# Altium schematic sheet CM6206.SchDoc
size 431 x 279 mm; Organization: ORGANIZATION; Address1: ADDRESS 1; Address2: ADDRESS 2; Address3: ADDRESS 3; Address4: ADDRESS 4; Revision: -; SheetNumber: 3; SheetTotal: 6; ENG_APP_DATE: --/--/--; DSN_APP_DATE: --/--/--; CHK_APP_DATE: --/--/--
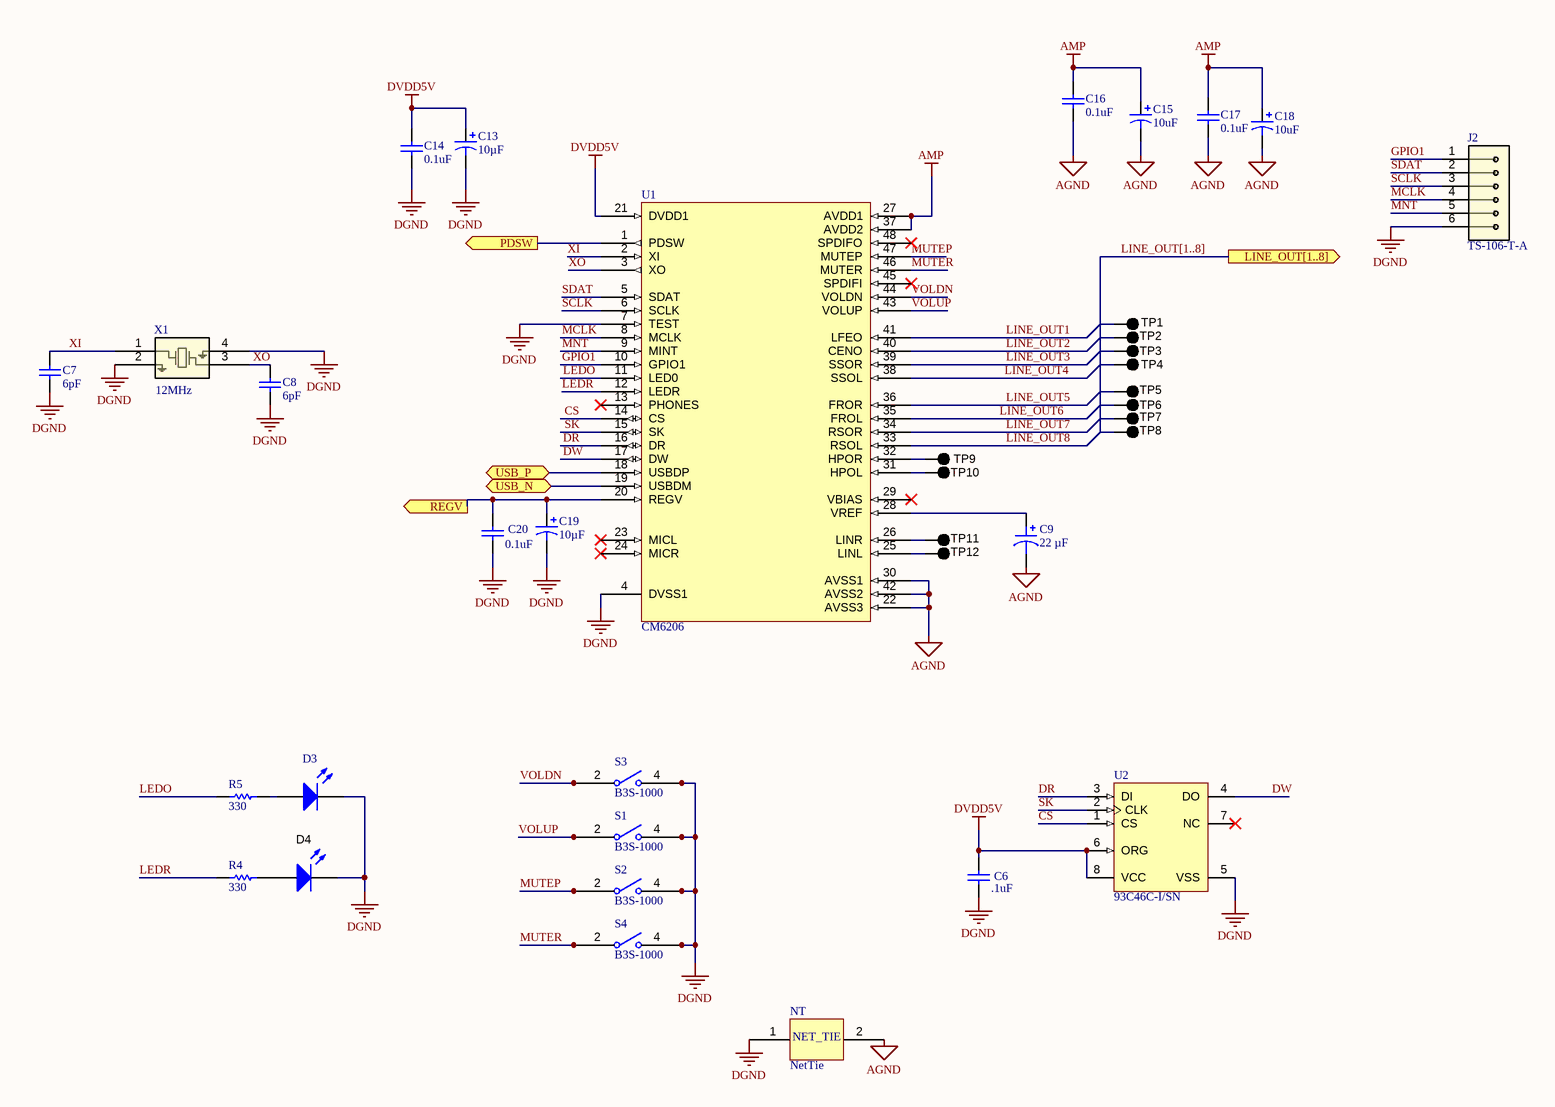
[diagram p0: CM6206.SchDoc]

## Parts
C6  .1uF  [0603]
C7  6pF  [0603]
C8  6pF  [0603]
C9  22 µF  [CAP POL 1411_3528]
C13  10µF  [1206 TANT CASE A]
C14  0.1uF  [0603]
C15  10uF  [1206 TANT CASE A]
C16  0.1uF  [0603]
C17  0.1uF  [0603]
C18  10uF  [1206 TANT CASE A]
C19  10µF  [1206 TANT CASE A]
C20  0.1uF  [0603]
D3  LTST-C190KGKT  [LED_LTST-C190]  (value not drawn)
D4  LB Q39G-L2OO-35-1  [LB Q39G_BLUE]  (value not drawn)
J2  TS-106-T-A  [CON6_1X6_TU_HTS_SAI]
NT  NetTie  [NetTie]  (net tie, no BOM)
R4  330  [0603]
R5  330  [0603]
S1  B3S-1000  [B3S-1000_OMR]
S2  B3S-1000  [B3S-1000_OMR]
S3  B3S-1000  [B3S-1000_OMR]
S4  B3S-1000  [B3S-1000_OMR]
TP1  5001  [Testpoint pad]  (value not drawn)
TP2  5001  [Testpoint pad]  (value not drawn)
TP3  5001  [Testpoint pad]  (value not drawn)
TP4  5001  [Testpoint pad]  (value not drawn)
TP5  5001  [Testpoint pad]  (value not drawn)
TP6  5001  [Testpoint pad]  (value not drawn)
TP7  5001  [Testpoint pad]  (value not drawn)
TP8  5001  [Testpoint pad]  (value not drawn)
TP9  5001  [Testpoint pad]  (value not drawn)
TP10  5001  [Testpoint pad]  (value not drawn)
TP11  5001  [Testpoint pad]  (value not drawn)
TP12  5001  [Testpoint pad]  (value not drawn)
U1  CM6206  [CM6206 LQFP48]
U2  93C46C-I/SN  [SOIC-SN8_N]
X1  ECS-120-8-36-CKM-TR3  [ECS-120-8_ECS]  (value not drawn)

## Ports
LINE_OUT[1..8] (out, see Top Level[6D]), PDSW (out, see Top Level[6E], Power[7E]), REGV (out, see Top Level[6E], USB Interface[5D]), USB_N (bidir, see Top Level[6E], USB Interface[5D]), USB_P (bidir, see Top Level[6E], USB Interface[5D])

## Nets
AGND: C9.2 C15.1 C16.1 C17.1 C18.1 NT.2 U1.22(AVSS3) U1.30(AVSS1) U1.42(AVSS2)
AMP: C15.2 C16.2 C17.2 C18.2 U1.27(AVDD1) U1.37(AVDD2)
DGND: C6.1 C7.1 C8.1 C13.1 C14.1 C19.1 C20.1 D3.2(K) D4.2(K) J2.6 NT.1 S1.3 S1.4 S2.3 S2.4 S3.3 S3.4 S4.3 S4.4 U1.4(DVSS1) U1.7(TEST) U2.5(VSS) X1.2 X1.4
DVDD5V: C6.2 C13.2 C14.2 U1.21(DVDD1) U2.6(ORG) U2.8(VCC)
CS: U1.14(CS) U2.1(CS)
DR: U1.16(DR) U2.3(DI)
DW: U1.17(DW) U2.4(DO)
GPIO1: J2.1 U1.10(GPIO1)
LEDO: R5.2 U1.11(LED0)
LEDR: R4.2 U1.12(LEDR)
LINE_OUT1: TP1.1 U1.41(LFEO)
LINE_OUT2: TP2.1 U1.40(CENO)
LINE_OUT3: TP3.1 U1.39(SSOR)
LINE_OUT4: TP4.1 U1.38(SSOL)
LINE_OUT5: TP5.1 U1.36(FROR)
LINE_OUT6: TP6.1 U1.35(FROL)
LINE_OUT7: TP7.1 U1.34(RSOR)
LINE_OUT8: TP8.1 U1.33(RSOL)
MCLK: J2.4 U1.8(MCLK)
MNT: J2.5 U1.9(MINT)
MUTEP: S2.1 S2.2 U1.47(MUTEP)
MUTER: S4.1 S4.2 U1.46(MUTER)
PDSW: U1.1(PDSW) ; port PDSW
REGV: C19.2 C20.2 U1.20(REGV) ; port REGV
SCLK: J2.3 U1.6(SCLK)
SDAT: J2.2 U1.5(SDAT)
SK: U1.15(SK) U2.2(CLK)
USB_N: U1.19(USBDM) ; port USB_N
USB_P: U1.18(USBDP) ; port USB_P
VOLDN: S3.1 S3.2 U1.44(VOLDN)
VOLUP: S1.1 S1.2 U1.43(VOLUP)
XI: C7.2 U1.2(XI) X1.1
XO: C8.2 U1.3(XO) X1.3
NetC9_1: C9.1 U1.28(VREF)
NetD3_1: D3.1(A) R5.1
NetD4_1: D4.1(A) R4.1
NetTP9_1: TP9.1 U1.32(HPOR)
NetTP10_1: TP10.1 U1.31(HPOL)
NetTP11_1: TP11.1 U1.26(LINR)
NetTP12_1: TP12.1 U1.25(LINL)

Not connected (* = marked no-connect by the designer): U1 13(PHONES)* 23(MICL)* 24(MICR)* 29(VBIAS)* 45(SPDIFI)* 48(SPDIFO)*; U2 7(NC)*

## Buses and harness runs
bus LINE_OUT[1..8] = port LINE_OUT[1..8]

## Notes on the sheet
- (near X1) 12MHz
- DWG. NO.
- REV.
- SHT.
- THIS DOCUMENT AND THE DATA DISCLOSED HEREIN OR HEREWITH IS THE PROPERTY OF ALTIUM LIMITED AND MAY BE FREELY DISTRIBUTED IN WHOLE. NO RIGHTS ARE RESERVED OR EXPRESS OR IMPLIED WARANTEE GIVEN.
- REVISION
- DESCRIPTION
- DATE
- APPROVED
- ENG:
- APPROVALS
- PROJECT
- DSN:
- CHK:
- REFERENCE DOCUMENTS
- PROJECT REVISION:
- TITLE
- DOCUMENT REVISION:
- DESIGN ITEM:
- BOM:
- FAB DWG:
- PCB DWG:
- ASSY DWG:
- SCALE:
- SIZE
- B
- CAGE CODE
- FILE NAME
- DWG NO.
- SHEET
- OF
- REV
- (in symbol NetTie) NET_TIE

## Library data of the parts
C6-C8 C14 C16 C17 C20 = C TBD 0603
C9 = T495B226K010ATE500: CAP TANT 22UF 10% 10V 1411; manufacturer: KEMET; Manufacturer Size Code: B; ESR (Equivalent Series Resistance): 500mOhm @ 100kHz; Lifetime @ Temp.: 2000 Hrs @ 125°C; Type: Molded; Part Number: T495B226K010ATE500; Value: 22 µF; Capacitance: 22 µF; componentlink1description: Datasheet; componentlink1url: https://api.kemet.com/component-edge/download/datasheet/T495B226K010ATE500.pdf; componentlink2description: DigiKey Link; componentlink2url: https://www.digikey.com/en/products/detail/kemet/T495B226K010ATE500/8763592; Device Package: 1411 (3528 Metric); Features: General Purpose; Height - Seated (Max): 0.083" (2.10mm); lastupdated: 6/3/2024 7:29:03 PM; Lifecycle Status: Active; Minimum Order: 1; Mounting Type: Surface Mount; Operating Temperature: -55°C ~ 125°C; Package / Case: 1411 (3528 Metric); packaging: TapeAndReel; partid: 6; Part Status: Active; price: 0.50; series: T495; Size / Dimension: 0.138" L x 0.110" W (3.50mm x 2.80mm); Supplier 1: DigiKey; Supplier Part Number 1: 399-18339-1-ND; Tolerance: ±10%; Voltage - Rated: 10 V
C13 C15 C18 C19 = T491A106M016AT: CAP TANT 10UF 16V 20% 1206; Manufacturer Size Code: A; Manufacturer: Kemet; ESR (Equivalent Series Resistance): 7 Ohm; Type: Molded; Lifetime @ Temp.: 2000 Hrs @ 85°C; Packaging: Cut Tape (CT); Tolerance: ±20%; Voltage - Rated: 16V; Operating Temperature: -55°C ~ 125°C; Mounting Type: Surface Mount; Package / Case: 1206 (3216 Metric); Size / Dimension: 0.126" L x 0.063" W (3.20mm x 1.60mm); Height - Seated (Max): 0.071" (1.80mm); Lead Spacing: -; Features: General Purpose; ComponentLink1URL: http://www.kemet.com/Lists/ProductCatalog/Attachments/254/KEM_T2005_T491.pdf; ComponentLink1Description: http://www.kemet.com/Lists/ProductCatalog/Attachments/254/KEM_T2005_T491.pdf; Supplier 1: Digi-Key; Supplier Part Number 1: 399-3687-1-ND; Manufacturer Part Number: T491A106M016AT; RoHS: RoHS Compliant; Category: Capacitors; Stock: 136950; Pricing: 1=0.41, 10=0.362, 50=0.2198, 100=0.181, 250=0.14476, 500=0.13184, 1000=0.11891 (USD)
  C13 C19: Capacitance: 10µF
  C15 C18: Capacitance: 10uF
D3 = LTST-C190KGKT: LED GREEN CLEAR 0603 SMD; Manufacturer: Lite-On Inc.; Wavelength - Dominant: 571nm; Wavelength - Peak: 574nm; Millicandela Rating: 35mcd; Voltage - Forward (Vf) (Typ): 2V; Current - Test: 20mA; Viewing Angle: 130°; Lens Color: Colorless; Lens Style/Size: Rectangle with Flat Top, 1.10mm x 0.80mm; Packaging: Cut Tape (CT); Color: Green; Lens Transparency: Clear; Package / Case: 0603 (1608 Metric); Supplier Device Package: *; Size / Dimension: 1.60mm L x 0.80mm W; Height (Max): 0.80mm; Mounting Type: Surface Mount; ComponentLink1URL: http://optoelectronics.liteon.com/upload/download/DS22-2000-074/S_110_LTST-C190KGKT.pdf; ComponentLink1Description: http://optoelectronics.liteon.com/upload/download/DS22-2000-074/S_110_LTST-C190KGKT.pdf; Supplier 1: Digi-Key; Supplier Part Number 1: 160-1435-1-ND; Manufacturer Part Number: LTST-C190KGKT; RoHS: RoHS Compliant; Category: Optoelectronics; Stock: 632012; Pricing: 1=0.24, 10=0.186, 100=0.1015, 250=0.06768, 500=0.05752, 1000=0.04399 (USD); Supplier 2: Mouser; Supplier Part Number 2: 859-LTST-C190KGKT
D4 = LB Q39G-L2N2-35-1: LED BLUE DIFFUSED 0603 SMD; Manufacturer: OSRAM; Vf_V: 2.85; Value2: 2.85V; Io_A: 0.15; Tjmax_C: 95; Value1: W; U/M: EA; Wavelength - Dominant: 470nm; Wavelength - Peak: 472nm; Millicandela Rating: 29.5mcd; Current - Test: 5mA; Viewing Angle: 155°, 135°; Lens Color: White; Lens Style/Size: Rectangle with Flat Top, 1.10mm x 0.80mm; CompType: LED; PartNumber: LB Q39G-L2N2-35-1; SymbolVersion: 2008-12-08; MountType: SMT; RoHS: Y; PackageReference: BLUE 0603 LED; Type: ?; Published: 2008-07-11; Publisher: Texas Instruments; ComponentLink1URL: http://catalog.osram-os.com/catalogue/catalogue.do;jsessionid=8F4D5D14036503CDC6D844D9AC77EBC1?act=downloadFile&favOid=02000006000372cb000100b6; ComponentLink1Description: Datasheet link; LatestRevisionDate: 2015-04-28; Supplier 1: Digi-Key; Supplier Part Number 1: 475-2816-1-ND; Supplier 2: Mouser; Supplier Part Number 2: 720-LBQ39GL2N2351; Packaging: Cut Tape (CT); Voltage - Forward (Vf) (Typ): 2.85V; Lens Transparency: Diffused; Package / Case: 0603 (1608 Metric); Supplier Device Package: *; Size / Dimension: 1.60mm L x 0.80mm W; Height (Max): 0.40mm; Mounting Type: Surface Mount; ComponentLink2URL: http://media.digikey.com/pdf/Data%20Sheets/Osram%20PDFs/LB_LT%20Q39G.pdf; ComponentLink2Description: http://media.digikey.com/pdf/Data%20Sheets/Osram%20PDFs/LB_LT%20Q39G.pdf; Manufacturer Part Number: LB Q39G-L2OO-35-1; Category: Optoelectronics; Stock: 53859; Pricing: 1=0.38, 10=0.266, 25=0.2184, 100=0.1746, 250=0.13092, 500=0.11902, 1000=0.09522 (USD); Color: blue
J2 = TS-106-T-A: No Description Available; Mfr_Name: Samtec Inc; RefDes: RefDes; Type: Type
NT = NetTie: NET_TIE FOR EDGE
R4 R5 = R TBD 0603
TP1-TP12 = 5001: TEST POINT PC MINI .040"D BLACK; Manufacturer: Keystone Electronics; Packaging: Bulk; Type: PC Test Point, Miniature; Terminal: 0.010" x 0.020" (0.25mm x 0.51mm) Phosphor Bronze Wire, Silver Plated; Mounting Type: 0.040" (1.02mm) Hole Diameter; Material: Base, Nylon 46, UL 94V-0; Color: Black; ComponentLink1URL: http://www.keyelco.com/product-pdf.cfm?p=1310; ComponentLink1Description: http://www.keyelco.com/product-pdf.cfm?p=1310; Supplier 1: Digi-Key; Supplier Part Number 1: 36-5001-ND; Manufacturer Part Number: 5001; RoHS: RoHS Compliant; Category: Test and Measurement; Stock: 443864; Pricing: 1=0.36, 10=0.327, 50=0.238, 100=0.2286, 250=0.20528, 500=0.19594, 1000=0.16328, 2500=0.14928, 5000=0.13995 (USD)
U2 = CMP-0162-00225-1: 1K, 128x8 or 64x16-bit, 5.0V Microwire Serial EEPROM, 8-Pin SOIC 150mil, Industrial Temperature; Code_JEDEC: MS-012; Code_IPC: SOIC127P600-8; PackageDescription: 8-Lead Plastic Small Outline (SN) - Narrow, 3.90mm Body [SOIC]; PackageReference: SOIC-SN8; PackageVersion: revBB, Aug-2009; DatasheetVersion: revG, May-2008
X1 = ECS-120-8-36-CKM-TR3: No Description Available; Mfr_Name: ECS International; Type: Crystals; RefDes: RefDes